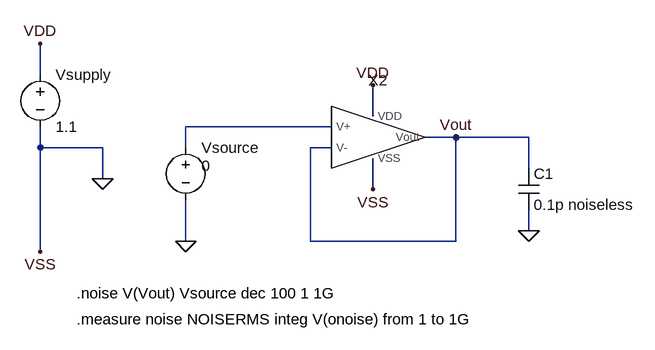
[diagram p0: schematic SIM_noise.asc]
SIM_noise.asc, the LTspice schematic file:
Version 4
SHEET 1 880 680
WIRE -224 16 -224 -32
WIRE 288 80 288 32
WIRE 224 96 0 96
WIRE 416 112 368 112
WIRE 528 112 416 112
WIRE -224 128 -224 96
WIRE -128 128 -224 128
WIRE 0 128 0 96
WIRE 224 128 192 128
WIRE 528 160 528 112
WIRE -128 176 -128 128
WIRE 288 192 288 144
WIRE 528 256 528 224
WIRE 0 272 0 208
WIRE 192 272 192 128
WIRE 416 272 416 112
WIRE 416 272 192 272
WIRE -224 288 -224 128
FLAG 0 272 0
FLAG -128 176 0
FLAG 288 32 VDD
FLAG 288 192 VSS
FLAG 528 256 0
FLAG -224 -32 VDD
FLAG -224 288 VSS
FLAG 416 112 Vout
SYMBOL voltage -224 0 R0
WINDOW 123 0 0 Left 0
WINDOW 39 0 0 Left 0
SYMATTR InstName Vsupply
SYMATTR Value 1.1
SYMBOL voltage 0 112 R0
WINDOW 3 24 44 Left 2
WINDOW 123 0 0 Left 0
WINDOW 39 0 0 Left 0
SYMATTR Value 0
SYMATTR InstName Vsource
SYMBOL cap 512 160 R0
SYMATTR InstName C1
SYMATTR Value 0.1p noiseless
SYMBOL OpAmp_V1 288 112 R0
SYMATTR InstName X2
TEXT -168 352 Left 2 !.noise V(Vout) Vsource dec 100 1 1G
TEXT -168 392 Left 2 !.measure noise NOISERMS integ V(onoise) from 1 to 1G

The netlist it stands for:
* SIM_noise.asc
Vsupply VDD 0 1.1
Vsource N001 0 0
C1 Vout 0 0.1p noiseless
XX2 N001 Vout VDD 0 Vout OpAmp_V1  ; pins V+ V- VDD VSS Vout
.noise V(Vout) Vsource dec 100 1 1G
.measure noise NOISERMS integ V(onoise) from 1 to 1G
.backanno
.end